# Altium project Badge.PrjPcb
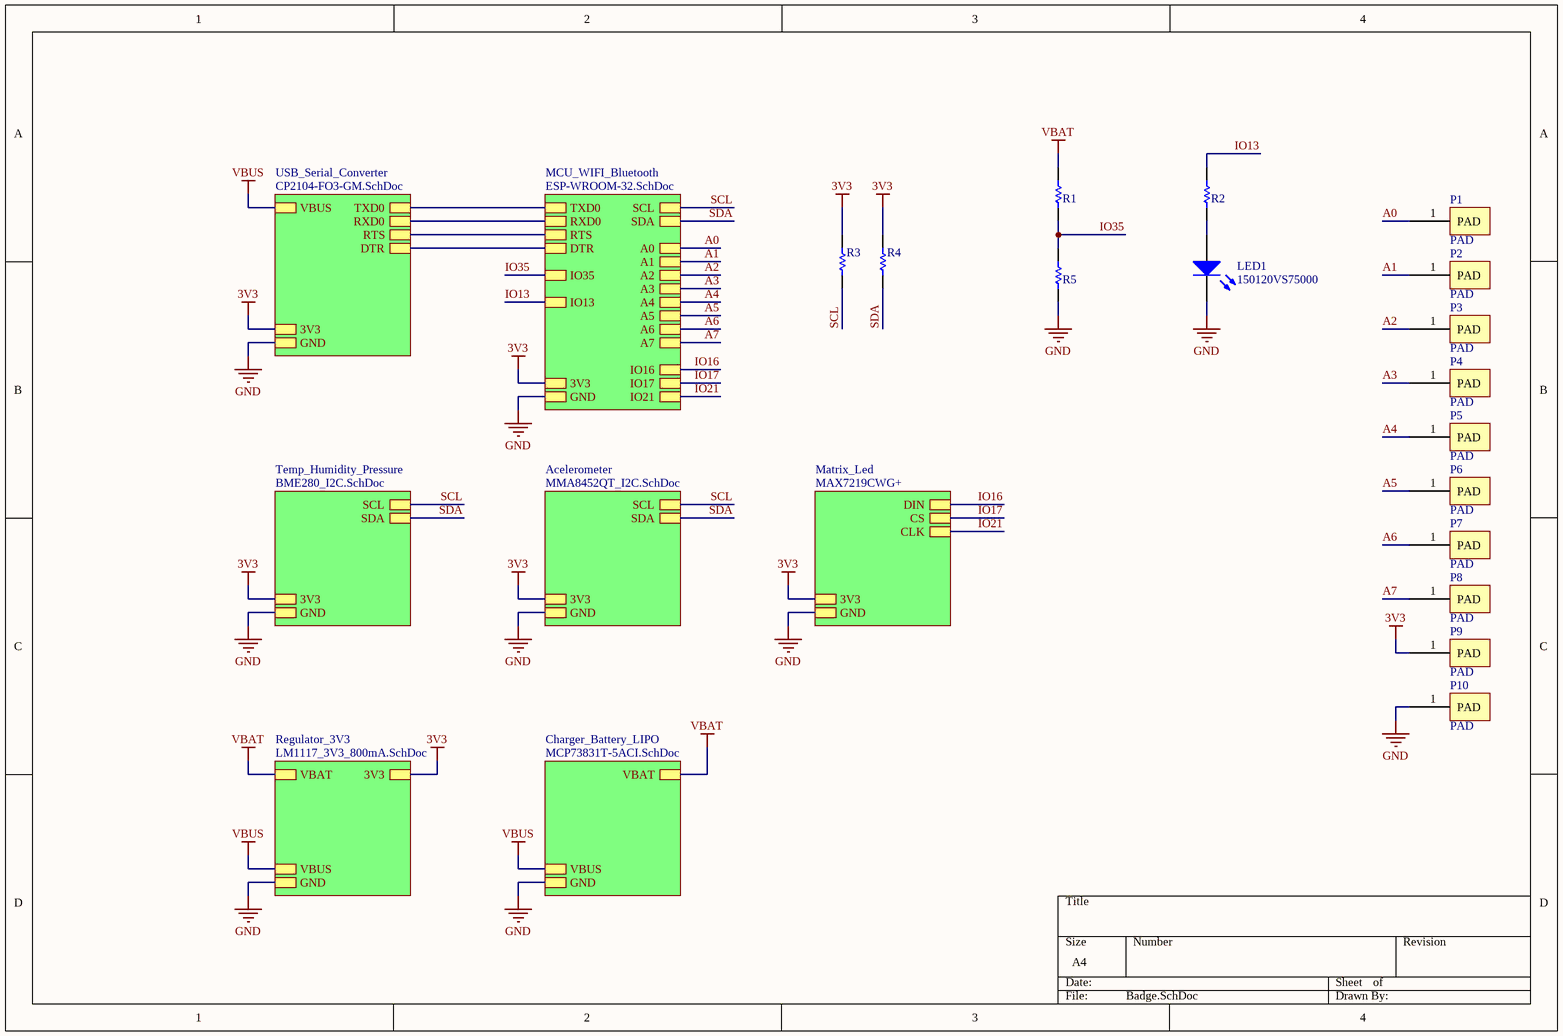
[diagram p0: Badge.SchDoc]
8 sheets, 54 parts. Net scope: hierarchical (ports join the sheet entries above them; power ports are global).
Board files: Badge_V1.PcbDoc, Badge_V1(isidro).PcbDoc, Badge_V2.PcbDoc, Badge_V2(isidro).PcbDoc
Sheets:
  Badge.SchDoc
    USB_Serial_Converter = CP2104-FO3-GM.SchDoc
    MCU_WIFI_Bluetooth = ESP-WROOM-32.SchDoc
    Acelerometer = MMA8452QT_I2C.SchDoc
    Temp_Humidity_Pressure = BME280_I2C.SchDoc
    Regulator_3V3 = LM1117_3V3_800mA.SchDoc
    Matrix_Led = MAX7219CWG+.SchDoc
    Charger_Battery_LIPO = MCP73831T-5ACI.SchDoc

## Sheet Badge.SchDoc
size A4

### Parts
LED1  150120VS75000  [1206_A]
P1  PAD  [Pad_C]
P2  PAD  [Pad_C]
P3  PAD  [Pad_C]
P4  PAD  [Pad_C]
P5  PAD  [Pad_C]
P6  PAD  [Pad_C]
P7  PAD  [Pad_C]
P8  PAD  [Pad_C]
P9  PAD  [Pad_C]
P10  PAD  [Pad_C]
R1  ERA6AEB104V  [RESC2013X60X40NL20T25]  (value not drawn)
R2  ERJ-P06J102V  [RESC2013X70X40NL20T20]  (value not drawn)
R3  RK73B2ATTD103J  [RESC2013X60X30NL20T20]  (value not drawn)
R4  RK73B2ATTD103J  [RESC2013X60X30NL20T20]  (value not drawn)
R5  ERA6AEB104V  [RESC2013X60X40NL20T25]  (value not drawn)

### Sub-sheets
Acelerometer = MMA8452QT_I2C.SchDoc: SDA, SCL, GND, 3V3
Charger_Battery_LIPO = MCP73831T-5ACI.SchDoc: GND, VBUS, VBAT
Matrix_Led = MAX7219CWG+: DIN, CS, CLK, 3V3, GND
MCU_WIFI_Bluetooth = ESP-WROOM-32.SchDoc: RTS, GND, RXD0, 3V3, SDA, DTR, TXD0, SCL, IO16, IO13, IO17, A2, A1, IO35, IO21, A7, A0, A3, A6, A4, A5
Regulator_3V3 = LM1117_3V3_800mA.SchDoc: 3V3, GND, VBUS, VBAT
Temp_Humidity_Pressure = BME280_I2C.SchDoc: GND, SDA, SCL, 3V3
USB_Serial_Converter = CP2104-FO3-GM.SchDoc: TXD0, DTR, RTS, RXD0, VBUS, 3V3, GND

### Nets
3V3: P9.1(PAD) R3.2 R4.2 ; sheet USB_Serial_Converter/3V3, sheet MCU_WIFI_Bluetooth/3V3, sheet Acelerometer/3V3, sheet Temp_Humidity_Pressure/3V3, sheet Regulator_3V3/3V3, sheet Matrix_Led/3V3
GND: LED1.1(K) P10.1(PAD) R5.1 ; sheet USB_Serial_Converter/GND, sheet MCU_WIFI_Bluetooth/GND, sheet Acelerometer/GND, sheet Temp_Humidity_Pressure/GND, sheet Regulator_3V3/GND, sheet Matrix_Led/GND, sheet Charger_Battery_LIPO/GND
VBAT: R1.2 ; sheet Regulator_3V3/VBAT, sheet Charger_Battery_LIPO/VBAT
VBUS: sheet USB_Serial_Converter/VBUS, sheet Regulator_3V3/VBUS, sheet Charger_Battery_LIPO/VBUS
A0: P1.1(PAD) ; sheet MCU_WIFI_Bluetooth/A0
A1: P2.1(PAD) ; sheet MCU_WIFI_Bluetooth/A1
A2: P3.1(PAD) ; sheet MCU_WIFI_Bluetooth/A2
A3: P4.1(PAD) ; sheet MCU_WIFI_Bluetooth/A3
A4: P5.1(PAD) ; sheet MCU_WIFI_Bluetooth/A4
A5: P6.1(PAD) ; sheet MCU_WIFI_Bluetooth/A5
A6: P7.1(PAD) ; sheet MCU_WIFI_Bluetooth/A6
A7: P8.1(PAD) ; sheet MCU_WIFI_Bluetooth/A7
DTR: sheet USB_Serial_Converter/DTR, sheet MCU_WIFI_Bluetooth/DTR
IO13: R2.2 ; sheet MCU_WIFI_Bluetooth/IO13
IO16: sheet MCU_WIFI_Bluetooth/IO16, sheet Matrix_Led/DIN
IO17: sheet MCU_WIFI_Bluetooth/IO17, sheet Matrix_Led/CS
IO21: sheet MCU_WIFI_Bluetooth/IO21, sheet Matrix_Led/CLK
IO35: R1.1 R5.2 ; sheet MCU_WIFI_Bluetooth/IO35
RTS: sheet USB_Serial_Converter/RTS, sheet MCU_WIFI_Bluetooth/RTS
RXD0: sheet USB_Serial_Converter/RXD0, sheet MCU_WIFI_Bluetooth/RXD0
SCL: R3.1 ; sheet MCU_WIFI_Bluetooth/SCL, sheet Acelerometer/SCL, sheet Temp_Humidity_Pressure/SCL
SDA: R4.1 ; sheet MCU_WIFI_Bluetooth/SDA, sheet Acelerometer/SDA, sheet Temp_Humidity_Pressure/SDA
TXD0: sheet USB_Serial_Converter/TXD0, sheet MCU_WIFI_Bluetooth/TXD0
NetLED1_2: LED1.2(A) R2.1

### Library data of the parts
LED1 = CMP-1426-00016-1: SMD mono-color Chip LED, WL-SMCW, Bright Green; Manufacturer: Wuerth Elektronik; ComponentLink2URL: http://katalog.we-online.com/led/datasheet/150120VS75000.pdf; PartNumber: 150120VS75000; Color: Bright Green; ComponentLink2Description: Datasheet; ComponentLink1URL: http://www.we-online.com; PackageReference: 1206_A; ComponentLink1Description: Manufacturer URL
P1-P10 = PAD: PAD 2mm
R1 R5 = CMP-2001-00583-1: 100 kOhms ±0.1% 0.125W, 1/8W Chip Resistor 0805 (2012 Metric) Automotive AEC-Q200 Thin Film; Manufacturer: Panasonic; Part Number: ERA6AEB104V
R2 = CMP-2001-00477-1: RES SMD 1K OHM 5% 1/2W 0805; Manufacturer: Panasonic; Part Number: ERJ-P06J102V
R3 R4 = CMP-2001-04657-1: 10 kOhms ±5% 0.25W, 1/4W Chip Resistor 0805 (2012 Metric) Automotive AEC-Q200, Moisture Resistant Thick Film; Manufacturer: KOA Speer; Part Number: RK73B2ATTD103J

## Sheet CP2104-FO3-GM.SchDoc
size A4
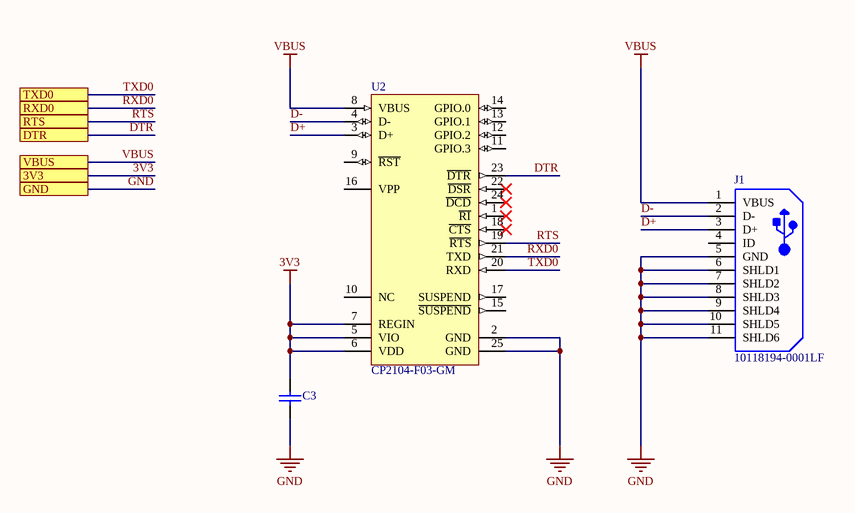
[diagram p1: CP2104-FO3-GM.SchDoc]

### Parts
C3  C0805C106K4PACTU  [CAPC2013X140X50NL20T25]  (value not drawn)
J1  10118194-0001LF  [FCI-10118194-0001LF-5_V]
U2  CP2104-F03-GM  [SLAB-QFN-24-2675x2675TP_M]

### Ports
3V3, DTR, GND, RTS, RXD0, TXD0, VBUS

### Nets
3V3: C3.2 U2.5(VIO) U2.6(VDD) U2.7(REGIN) ; port 3V3
GND: C3.1 J1.5(GND) J1.6(SHLD1) J1.7(SHLD2) J1.8(SHLD3) J1.9(SHLD4) J1.10(SHLD5) J1.11(SHLD6) U2.2(GND) U2.25(GND) ; port GND
VBUS: J1.1(VBUS) U2.8(VBUS) ; port VBUS
D+: J1.3(D+) U2.3(D+)
D-: J1.2(D-) U2.4(D-)
DTR: U2.23(~{DTR}) ; port DTR
RTS: U2.19(~{RTS}) ; port RTS
RXD0: U2.21(TXD) ; port RXD0
TXD0: U2.20(RXD) ; port TXD0

Not connected (* = marked no-connect by the designer): J1 4(ID); U2 1(~{RI})* 9(~{RST}) 10(NC) 11(GPIO.3) 12(GPIO.2) 13(GPIO.1) 14(GPIO.0) 15(~{SUSPEND}) 16(VPP) 17(SUSPEND) 18(~{CTS})* 22(~{DSR})* 24(~{DCD})*

### Library data of the parts
C3 = CMP-2007-03242-1: 10µF ±10% 16V Ceramic Capacitor X5R 0805 (2012 Metric); Part Number: CL21A106KOQNNNG
J1 = CMP-2000-05120-1: Micro USB B Type Receptacle, 1.8 A, -55 to 85 degC, 5-Pin SMD, RoHS, Tape and Reel; Manufacturer: Amphenol FCI; Body Orientation: RightAngle; Number of Contacts: 5; Pitch: 0.65mm; Gender: RCP; Rad Hard: No; Package Reference: 10118194-0001LF-5; Mounting: SurfaceMount; Manufacturer URL: http://www.fci.com/; Packaging: CutTape; Datasheet URL: https://datasheet.ciiva.com/26945/getdatasheetpartid-418619-26945695.pdf; Termination Method: Solder; Package Description: 5-Pin Surface Mount Device, Body 8.05 x 5.53 mm, Pitch 0.65 mm; Type: MicroUSBTypeB; Datasheet Version: Rev. A, 10/2011
U2 = CMP-0511-00004-1: Single-Chip USB to UART Bridge, 4 Dig I/O Pins, Internal Oscillator, 1024 Bytes EEPROM, -40 to 85 degC, 24-pin QFN; Manufacturer: Silicon Labs; Sub-Family: USB Bridges; Internal Oscillator: TRUE; Mounting Technology: Surface Mount; ComponentLink3URL: http://www.silabs.com/Support%20Documents/TechnicalDocs/C8051F93x-92x.pdf; DatasheetVersion: Rev. 1.0; ComponentLink1URL: http://www.silabs.com/; Code_IPC: J-STD-020; ComponentLink2URL: http://www.silabs.com/Support%20Documents/TechnicalDocs/cp2104.pdf; Code_JEDEC: MO-220; PackageReference: QFN-24; ComponentLink3Description: Package Specification; PartNumber: CP2104-F03-GM; ComponentLink1Description: Manufacturer URL; ComponentLink2Description: Datasheet; EEPROM: 1024 Bytes; PackageDescription: 24-Pin Quad-Flat No-Leads Package, Body 4 x 4 mm, Pitch 0.5 mm

## Sheet ESP-WROOM-32.SchDoc
size A4
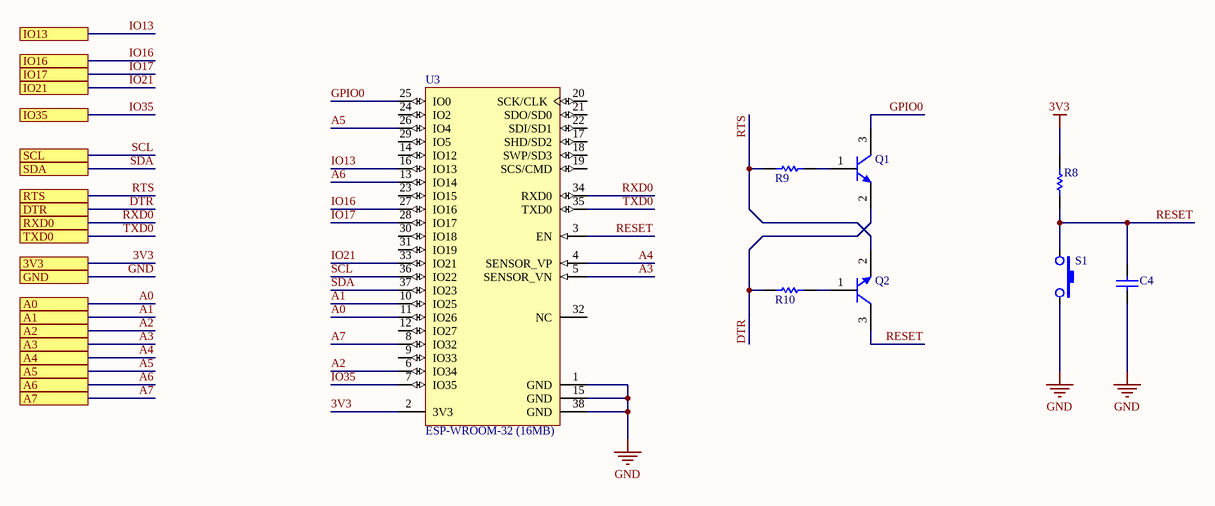
[diagram p2: ESP-WROOM-32.SchDoc]

### Parts
C4  C0805C105K4RAC7800  [CAPC2013X145X50NL20T25]  (value not drawn)
Q1  MMBT2222ALT1G  [ONSC-SOT-23-3-318-08_V]  (value not drawn)
Q2  MMBT2222ALT1G  [ONSC-SOT-23-3-318-08_V]  (value not drawn)
R8  RK73B2ATTD103J  [RESC2013X60X30NL20T20]  (value not drawn)
R9  RK73B2ATTD103J  [RESC2013X60X30NL20T20]  (value not drawn)
R10  RK73B2ATTD103J  [RESC2013X60X30NL20T20]  (value not drawn)
S1  PTS820J25MSMTRLFS  [SMT_SW_PTS_820]  (value not drawn)
U3  ESP-WROOM-32 (16MB)  [OLMX-ESP-WROOM-32]

### Ports
3V3, A0, A1, A2, A3, A4, A5, A6, A7, DTR, GND, IO13, IO16, IO17, IO21, IO35, RTS, RXD0, SCL, SDA, TXD0

### Nets
3V3: R8.2 U3.2(3V3) ; port 3V3
GND: C4.1 S1.2 U3.1(GND) U3.15(GND) U3.38(GND) ; port GND
A0: U3.11(IO26) ; port A0
A1: U3.10(IO25) ; port A1
A2: U3.6(IO34) ; port A2
A3: U3.5(SENSOR_VN) ; port A3
A4: U3.4(SENSOR_VP) ; port A4
A5: U3.26(IO4) ; port A5
A6: U3.13(IO14) ; port A6
A7: U3.8(IO32) ; port A7
DTR: Q1.2(E) R10.2 ; port DTR
GPIO0: Q1.3(C) U3.25(IO0)
IO13: U3.16(IO13) ; port IO13
IO16: U3.27(IO16) ; port IO16
IO17: U3.28(IO17) ; port IO17
IO21: U3.33(IO21) ; port IO21
IO35: U3.7(IO35) ; port IO35
RESET: C4.2 Q2.3(C) R8.1 S1.1 U3.3(EN)
RTS: Q2.2(E) R9.2 ; port RTS
RXD0: U3.34(RXD0) ; port RXD0
SCL: U3.36(IO22) ; port SCL
SDA: U3.37(IO23) ; port SDA
TXD0: U3.35(TXD0) ; port TXD0
NetQ1_1: Q1.1(B) R9.1
NetQ2_1: Q2.1(B) R10.1

Not connected (* = marked no-connect by the designer): U3 9(IO33) 12(IO27) 14(IO12) 17(SHD/SD2) 18(SWP/SD3) 19(SCS/CMD) 20(SCK/CLK) 21(SDO/SD0) 22(SDI/SD1) 23(IO15) 24(IO2) 29(IO5) 30(IO18) 31(IO19) 32(NC)

### Library data of the parts
C4 = CMP-2007-01082-1: 1µF ±10% 16V Ceramic Capacitor X7R 0805 (2012 Metric); Manufacturer: Kemet; Part Number: C0805C105K4RAC7800
Q1 Q2 = CMP-1048-00538-1: General Purpose Transistor, NPN Silicon, 3-Pin SOT-23, Pb-Free, Tape and Reel; Manufacturer: On Semiconductor; fT Min (MHz): 300; IC Continuous (A): 0.6; ComponentLink3URL: http://www.onsemi.cn/pub_link/Collateral/318-08.PDF; PartNumber: MMBT2222ALT1G; RoHS: TRUE; ComponentLink1URL: http://www.onsemi.com/; ComponentLink3Description: Package Specification; ComponentLink2Description: Datasheet; Mounting Technology: Surface Mount; Packing: Tape and Reel; PackageDescription: 3-Pin Small Outline Transistor, Body 2.92 x 1.3 mm, Pitch 0.95 mm; DatasheetVersion: Rev. 10; PackageReference: SOT-23-3-318-08; ComponentLink2URL: http://www.onsemi.cn/pub_link/Collateral/MMBT2222LT1-D.PDF; Polarity: NPN; PackageVersion: Rev. AP, 11/2009; ComponentLink1Description: Manufacturer URL
R8-R10 = CMP-2001-04657-1: as R3 on sheet Badge; Part Number: RK73B2ATTD103J
S1 = PTS820J25MSMTRLFS: Tactile Switch SPST-NO Top Actuated Surface Moun
U3 = CMP-2000-07454-1: Espressif System, 2.7 to 3.6 V, -40 to 85 degC, 38-Pin SMD; Package Description: 38-Pin Surface Mount Device, Body 18 x 25.5 mm, Pitch 1.27 mm; RoHSCompliant: false; Mounting Technology: SurfaceMount; Package Reference: ESP-WROOM-32 (16MB)

## Sheet MMA8452QT_I2C.SchDoc
size A4
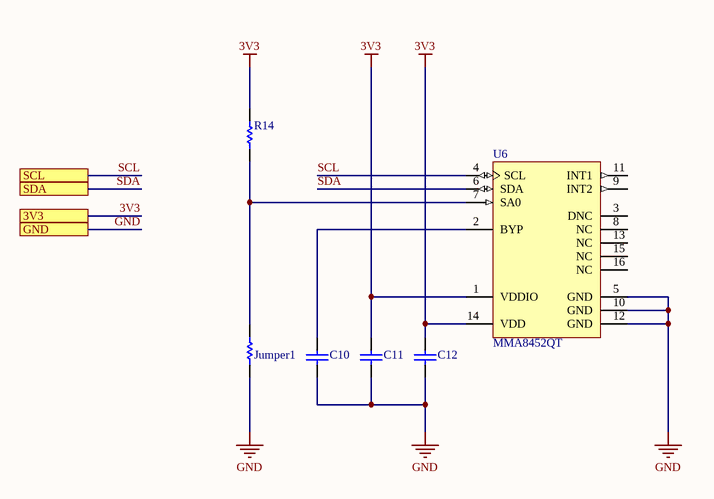
[diagram p3: MMA8452QT_I2C.SchDoc]

### Parts
C10  C0805C104J5RAC7800  [CAPC2013X145X50NL20T25]  (value not drawn)
C11  C0805C104J5RAC7800  [CAPC2013X145X50NL20T25]  (value not drawn)
C12  08053D475KAT2A  [CAPC2013X140X50NL20T25]  (value not drawn)
Jumper1  (no value)  [RESC2013X60X40NL20T25_A]
R14  RK73B2ATTD103J  [RESC2013X60X30NL20T20]  (value not drawn)
U6  MMA8452QT  [FRES-SOT1676-1_V]

### Ports
3V3, GND, SCL, SDA

### Nets
3V3: C11.2 C12.2 R14.2 U6.1(VDDIO) U6.14(VDD) ; port 3V3
GND: C10.1 C11.1 C12.1 Jumper1.1 U6.5(GND) U6.10(GND) U6.12(GND) ; port GND
SCL: U6.4(SCL) ; port SCL
SDA: U6.6(SDA) ; port SDA
NetC10_2: C10.2 U6.2(BYP)
NetJumper1_2: Jumper1.2 R14.1 U6.7(SA0)

Not connected (* = marked no-connect by the designer): U6 3(DNC) 8(NC) 9(INT2) 11(INT1) 13(NC) 15(NC) 16(NC)

### Library data of the parts
C10 C11 = CMP-2007-01102-1: 0.1µF ±5% 50V Ceramic Capacitor X7R 0805 (2012 Metric); Manufacturer: Kemet; Part Number: C0805C104J5RAC7800
C12 = CMP-2007-04614-1: 4.7µF ±10% 25V Ceramic Capacitor X5R 0805 (2012 Metric); Manufacturer: AVX Interconnect / Elco; Part Number: 08053D475KAT2A
Jumper1 = CMP-2000-06228-1: Tolerance: 0.1%; Voltage Rating: 100V; Power Rating: 125mW(1/8W); Brand: Panasonic; Temperature Coefficient: 25PPM/C; Resistance: 10kOhms; Product Category: ThinFilmResistors-SMD; Operating Temperature Range: -55Cto+155C; Length: 2mm; Mounting Technology: SurfaceMount; Manufacturer URL: http://www.panasonic.com/; Width: 1.25mm; Packaging: Reel; Product: ThinFilmResistorsSMD; Package / Case: 0805(2012metric); Termination Style: SMD/SMT; Package Description: 2-Pin Surface Mount Device, Body 2 x 1.25 mm; Factory Pack Quantity: 5000; Series: ERA-6A; Case Code - mm: 2012; RoHS: Details; Package Reference: 0805; Height: 0.5mm; Manufacturer: Panasonic; Case Code - in: 0805; Type: MetalFilmChipResistors
R14 = CMP-2001-04657-1: as R3 on sheet Badge; Part Number: RK73B2ATTD103J
U6 = CMP-2000-06726-1: 3-Axis, 12-Bit / 8-Bit Digital Accelerometer, 1.95 to 3.6 V, -40 to 85 degC, 16-Pin QFN (SOT1676-1), RoHS, Tray; Manufacturer: Freescale; Maximum Frequency Response: 400kHz; Frequency Response Range: 0→400kHz; Noise: 99µg/√Hz; Sensitivity: 256counts/g,512counts/g,1024counts/g; Interface Type: Serial-I2C; Minimum Operating Supply Voltage: 1.95V; Operating Supply Voltage Range: 1.95→3.6V; Package Version: Rev. B, 01/2016; Minimum Frequency Response: 0kHz; Maximum Operating Supply Voltage: 3.6V; Number of Axis: 3; Sensor Range: ±2g,±4g,±8g; Technology: Digital; Minimum Operating Temperature: -40°C; Mounting Type: SurfaceMount; Datasheet URL: http://cache.nxp.com/files/sensors/doc/data_sheet/MMA8452Q.pdf?fpsp=1&WT_TYPE=Data%20Sheets&WT_VENDOR=FREESCALE&WT_FILE_FORMAT=pdf&WT_ASSET=Documentation&fileExt=.pdf; Operating Temperature Range: -40→+85°C; Height: 1mm; Package Description: 16-Pin Quad Flat No-lead Package, Body 3 x 3 mm, Pitch 0.5 mm; Dimensions: 3x3x1mm; Mounting Technology: SurfaceMount; Pin Count: 16; Package Type: QFN; Length: 3mm; Datasheet Version: Rev. 10, 04/2016; Package Reference: SOT1676-1; Width: 3mm; Maximum Operating Temperature: +85°C; Package URL: http://cache.freescale.com/files/shared/doc/package_info/98ASA00063D.pdf; Manufacturer URL: http://www.nxp.com/

## Sheet BME280_I2C.SchDoc
size A4
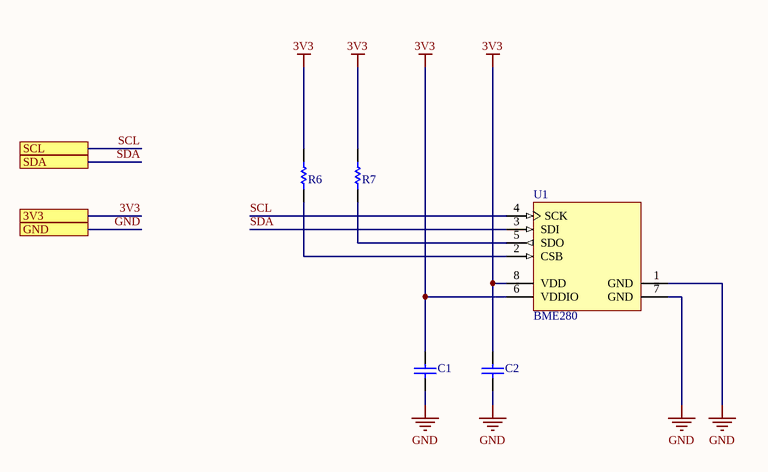
[diagram p4: BME280_I2C.SchDoc]

### Parts
C1  C0805C104J5RAC7800  [CAPC2013X145X50NL20T25]  (value not drawn)
C2  C0805C104J5RAC7800  [CAPC2013X145X50NL20T25]  (value not drawn)
R6  RC0805JR-074K7L  [RESC2013X60X30NL20T20]  (value not drawn)
R7  RC0805JR-074K7L  [RESC2013X60X30NL20T20]  (value not drawn)
U1  BME280  [BOSC-BME280-8_V]

### Ports
3V3, GND, SCL, SDA

### Nets
3V3: C1.2 C2.2 R6.2 R7.2 U1.6(VDDIO) U1.8(VDD) ; port 3V3
GND: C1.1 C2.1 U1.1(GND) U1.7(GND) ; port GND
SCL: U1.4(SCK) ; port SCL
SDA: U1.3(SDI) ; port SDA
NetR6_1: R6.1 U1.2(CSB)
NetR7_1: R7.1 U1.5(SDO)

### Library data of the parts
C1 C2 = CMP-2007-01102-1: as C10 on sheet MMA8452QT_I2C; Part Number: C0805C104J5RAC7800
R6 R7 = RC0805JR-074K7L: 4.7 kOhms ±5% 0.125W, 1/8W Chip Resistor 0805 (2012 Metric) Moisture Resistant Thick Film; Manufacturer: Yageo; Part Number: RC0805JR-074K7L
U1 = CMP-2000-05073-1: Combined Humidity and Pressure Sensor, 1.71 to 3.6 V, -40 to 85 degC, 8-Pin SMD, RoHS, Tape and Reel; Manufacturer: Bosch Sensortec; Datasheet Version: Rev. 1.2, 10/2015; Datasheet URL: http://datasheet.octopart.com/BME280-Bosch-datasheet-58577763.pdf; Manufacturer URL: http://www.bosch-sensortec.com; ComponentLink1Description: BME280; ComponentLink1URL: https://co.mouser.com/ProductDetail/Bosch-Sensortec/BME280?qs=sGAEpiMZZMsF1ODjcwEocB0teEbUEBlMe2ty%252bXJvNLw%3d

## Sheet LM1117_3V3_800mA.SchDoc
size A4
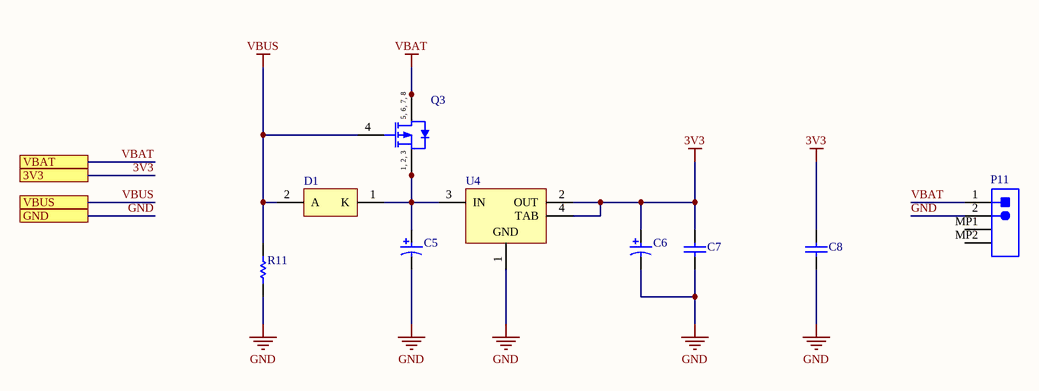
[diagram p5: LM1117_3V3_800mA.SchDoc]

### Parts
C5  T491A106K016AT  [KEMT-A-3216-18-2_N]  (value not drawn)
C6  T491A106K016AT  [KEMT-A-3216-18-2_N]  (value not drawn)
C7  C0805C105K4RAC7800  [CAPC2013X145X50ML20T25]  (value not drawn)
C8  C0805C106K4PACTU  [CAPC2013X140X50ML20T25]  (value not drawn)
D1  MBR120ESFT1G  [ONSC-SOD-123FL-2-498_V]  (value not drawn)
P11  S2B-PH-SM4-TB(LF)(SN)  [JST- S2B-PH-SM4-TB(LF)(SN)-2_V]  (value not drawn)
Q3  BSZ086P03NS3 G  [INF-PG-TSDSON-8-1_V]  (value not drawn)
R11  ERA6AEB104V  [RESC2013X60X40ML20T25]  (value not drawn)
U4  LM1117MPX-3.3/NOPB  [DCY0004A_N]  (value not drawn)

### Ports
3V3, GND, VBAT, VBUS

### Nets
3V3: C6.1 C7.2 C8.2 U4.2(OUT) U4.4(TAB) ; port 3V3
GND: C5.2 C6.2 C7.1 C8.1 P11.2 R11.1 U4.1(GND) ; port GND
VBAT: P11.1 Q3.5(DRAIN) Q3.6(DRAIN) Q3.7(DRAIN) Q3.8(DRAIN) ; port VBAT
VBUS: D1.2(A) Q3.4(GATE) R11.2 ; port VBUS
NetC5_1: C5.1 D1.1(K) Q3.1(SOURCE) Q3.2(SOURCE) Q3.3(SOURCE) U4.3(IN)

Not connected (* = marked no-connect by the designer): P11 MP1 MP2

### Notes on the sheet
- (in symbol CMP-1099-00063-1) 5, 6, 7, 8; 1, 2, 3

### Library data of the parts
C5 C6 = CMP-2000-05173-1: Capacitor, Tantalum, 10 uF, +/- 10%, 16 V, -55 to 125 degC, 2-Pin SMD (1206), RoHS, Tape and Reel; Manufacturer: Kemet; Insulation: NotRequired; Voltage: 16VDC; Capacitance: 10uF; Product Height (mm): 1.6mm; Polarity: Polar; Lead Spacing (nom): NotRequiredmm; Product Length (mm): 3.2mm; Case Style: Molded; DCL: 1.6uA; ESR: 7ohm; DF: 8%; Mounting Style: SurfaceMount; Manufacturer URL: http://www.kemet.com/; Datasheet Version: Apr-14; Package Description: 2-Pin Surface Mount Device, Body 3.2 x 1.6 mm; Operating Temp Range: -55Cto125C; Package Reference: 1206; Wire Form: NotRequired; Datasheet URL: http://www.farnell.com/datasheets/1824869.pdf; Tolerance (+ or -): 10%; Failure Rate: NotRequired; Length W/Weld: NotRequiredmm; Package / Case: 3216-18; Seated Plane Height: NotRequiredmm; Product Diameter (mm): NotRequiredmm; Construction: SMTChip; Seal: NotRequired; Case Code: A; Product Depth (mm): 1.6mm; Packaging: TapeandReel
C7 = CMP-2007-01082-1: as C4 on sheet ESP-WROOM-32; Part Number: C0805C105K4RAC7800
C8 = CMP-2007-03242-1: as C3 on sheet CP2104-FO3-GM
D1 = CMP-1055-00434-1: Schottky Power Rectifier, 2-Pin SOD-123, Pb-Free, Tape and Reel; Manufacturer: On Semiconductor; Configuration: Single; IFSM Max (A): 40; ComponentLink2URL: http://www.onsemi.cn/pub_link/Collateral/MBR120ESFT1-D.PDF; PackageDescription: 2-Pin SOD, Body 1.65 x 2.7 mm; RoHS: TRUE; ComponentLink1URL: http://www.onsemi.com/; PackageVersion: Rev. D, 05/2013; PartNumber: MBR120ESFT1G; PackageReference: SOD-123FL-2-498; ComponentLink2Description: Datasheet; ComponentLink1Description: Manufacturer URL; DatasheetVersion: Rev. 4; ComponentLink3Description: Package Specification; ComponentLink3URL: http://www.onsemi.com/pub_link/Collateral/498-01.PDF; Mounting Technology: Surface Mount; Packing: Tape and Reel
P11 = CMP-1755-00001-1: Male Header, Pitch 2 mm, 1 x 2 Position, Height 5.5 mm, -25 to 85 degC, RoHS, Tape and Reel; Current Rating: 3 A; ComponentLink1URL: http://www.jst.com/home2.html; Radiation Hardening: No; RoHSCompliant: True; Mount: Through Hole; Contact Material: Bronze; Package Quantity: 100; Width: 2.34 mm; DatasheetVersion: Dec-12; Height: 8.13 mm; Max Operating Temperature: 105degC; ComponentLink2Description: Datasheet; Lead Pitch: 0.1 inch; Contact Finish: Lead; Packaging: Bulk; Colour: Black; Contact Plating: Tin; Min Operating Temperature: -65degC; ComponentLink1Description: Manufacturer URL; PackageReference: S2B-PH-SM4-TB(LF)(SN)-2; PackageDescription: Male Header, Pitch 2 mm, 1 x 2 Position, Height 5.5 mm; ComponentLink2URL: http://www.jst-mfg.com/product/pdf/eng/ePH.pdf; Pins: 40; Length: 101.19 mm
Q3 = CMP-1099-00063-1: P-Channel OptiMOS P3 Power-Transistor, -30 V VDS, -40 A ID, -55 to 150 degC, PG-TSDSON-8-1, Reel, Green; Manufacturer: Infineon; RDS (on) (max): 8.6Â mOhm; Rth: 1.8Â K/W; QG: 43.2Â nC; VGS(th) (max): -1.9Â V; RthJC (max): 1.8 K/W; Green: TRUE; Pto t (max): 69Â W; ID (max): -40Â A; IDpuls (max): -160Â A; VDS (max): -30Â V; VGS(th) (min): -3.1Â V; ComponentLink1URL: http://www.infineon.com/; ComponentLink2URL: http://www.infineon.com/dgdl/BSZ086P03NS3+G_2.03.pdf?folderId=db3a304314dca38901154a7313d21a66&fileId=db3a30431ff9881501203d3a5e7d17a9; Mounting Technology: Surface Mount; Part Number: BSZ086P03NS3 G; Packing: Reel; PackageVersion: Rev. 02, 09/2008; Halogen-free: TRUE; ComponentLink3URL: http://www.infineon.com/dgdl/BSZ240N12NS3+Rev2.0.pdf?folderId=db3a304313b8b5a60113cee8763b02d7&fileId=db3a30432a40a650012a42f3057a0038; PackageDescription: 8-Pin Plastic (Green) Thin Dual Small Outline Non-Leaded Package, 3.3 x 3.3 mm Body, 0.65 mm Pitch; PackageReference: PG-TSDSON-8-1; DatasheetVersion: Rev. 2.03; ComponentLink2Description: Datasheet; ComponentLink3Description: Package Specification; ComponentLink1Description: Manufacturer URL
R11 = CMP-2001-00583-1: as R1 on sheet Badge; Part Number: ERA6AEB104V
U4 = CMP-0062-01639-4: 800mA Low-Dropout Linear Regulator, 4-pin SOT-223, Pb-Free; Manufacturer: Texas Instruments; High-Reliability: Y; PowerWise: N; PackageTopMarking: XYTT*N05A; CompType: LDO IC; ComponentLink1URL: http://www.ti.com/general/docs/lit/getliterature.tsp?genericPartNumber=LM1117-N&fileType=pdf; PartNumber: LM1117MPX-3.3/NOPB; ComponentLink1Description: Datasheet URL; PinCount: 4; Code_JEDEC: TO-261-AA; PackageDescription: Molded SOT-223, 6.50 x 3.56 x 1.6mm Body, 4 Lead, 2.3mm Pitch; PackageReference: DCY0004A; RoHS: Y; Code_IPC: SOT223-4

## Sheet MAX7219CWG+.SchDoc
size A4
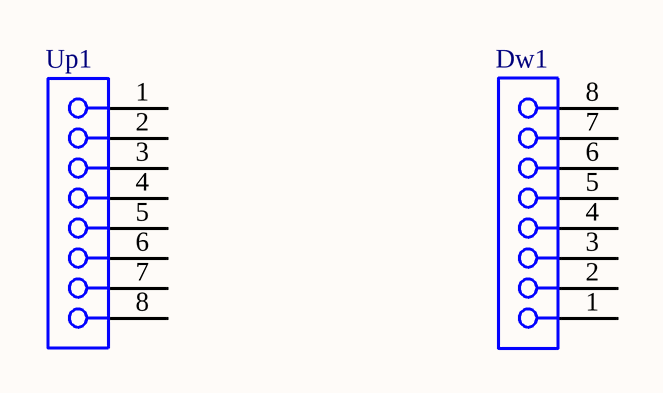
[diagram p6: MAX7219CWG+.SchDoc]

### Parts
Dw1  SSQ-108-01-G-S  [SMTC-SSQ-108-01-X-S]  (value not drawn)
Up1  SSQ-108-01-G-S  [SMTC-SSQ-108-01-X-S]  (value not drawn)

### Nets

Not connected (* = marked no-connect by the designer): Dw1 1 2 3 4 5 6 7 8; Up1 1 2 3 4 5 6 7 8

### Library data of the parts
Dw1 Up1 = CMP-1023-00292-1: SQ Post Socket, Through-hole, Vertical, -55 to 125 degC, 2.54 mm Pitch, 8-Pin, Female, RoHS; Manufacturer: Samtec; Pitch: 2.54 mm; ComponentLink3URL: http://www.samtec.com/documents/webfiles/cpdf/SSQ-1XX-XX-XXX-X-XX-XXX-XX-X-MKT.pdf; ComponentLink3Description: Package Specification; RoHS: True; ComponentLink1URL: http://www.samtec.com; Mounting Technology: Through-hole; PackageVersion: BD, 6/1987; ComponentLink1Description: Manufacturer URL; PartNumber: SSQ-108-01-G-S; ComponentLink2Description: Datasheet; Temperature Range: -55 to 125 degC; ComponentLink2URL: http://www.samtec.com/documents/webfiles/pdf/SSQ_TH.PDF; PackageDescription: Assembly, Socket Strip .025[0.64] SQ Tail; PackageReference: SSQ-108-01-X-S; Orientation: Vertical; DatasheetVersion: F-214

## Sheet MCP73831T-5ACI.SchDoc
size A4
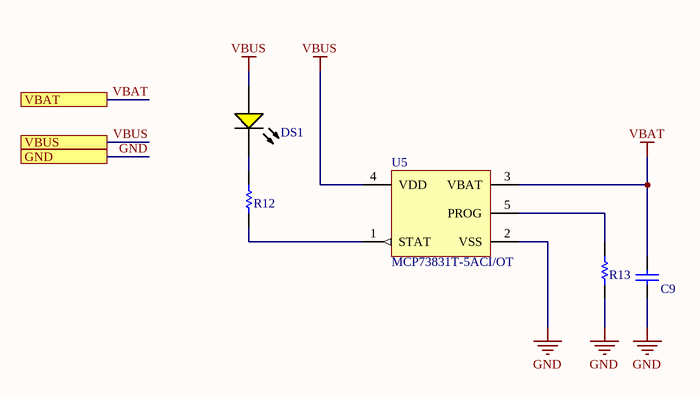
[diagram p7: MCP73831T-5ACI.SchDoc]

### Parts
C9  C0805C106K4PACTU  [CAPC2013X140X50NL20T25]  (value not drawn)
DS1  LTST-C150KSKT  [LTST-C150KSKT_V]  (value not drawn)
R12  ERJ-P06J102V  [RESC2013X70X40NL20T20]  (value not drawn)
R13  RC0805JR-074K7L  [RESC2013X60X30NL20T20]  (value not drawn)
U5  MCP73831T-5ACI/OT  [SOT-23-OT5_N]

### Ports
GND, VBAT, VBUS

### Nets
GND: C9.2 R13.2 U5.2(VSS) ; port GND
VBAT: C9.1 U5.3(VBAT) ; port VBAT
VBUS: DS1.1(A) U5.4(VDD) ; port VBUS
NetDS1_2: DS1.2(K) R12.2
NetR12_1: R12.1 U5.1(STAT)
NetR13_1: R13.1 U5.5(PROG)

### Library data of the parts
C9 = CMP-2007-03242-1: as C3 on sheet CP2104-FO3-GM
DS1 = CMP-2000-06618-1: LED Yellow, 75 mW, 80 mA, -55 to 85 degC, 2-Pin SMD, RoHS, Tape and Reel; Manufacturer: Lite-On; Forward Current: 30mA; Product Depth (mm): 1.6mm; DELETED: Compliant; Product Length (mm): 3.2mm; Type: Uni-Color; Product Height (mm): 1.1mm; Viewing Angle: 130deg; Number of  Elements: 1; Main Category: ChipLED; Forward Voltage: 2.4V; Test Current (It): 20mA; Shape Type: Rectangular; Chip Material: AlGaInP; Rad Hardened: No; Emitting Color: Amber; Luminous Intensity: 60mcd; High Brightness: Yes; Dominant Wave Length: 587nm; Reverse Voltage: 5V; Peak Wavelength: 588nm; Power Dissipation: 75W; Packaging: TapeandReel; Lens Dimensions: 2.06X1.6X0.6mm; Operating Temp Range: -55Cto85C; Pin Count: 2; Datasheet Version: Rev. E, 02/2005; Package Description: 2-Pin Surface Mount Device, Body 3.2 x 1.6 mm; Mounting: SurfaceMount; Datasheet URL: http://optoelectronics.liteon.com/upload/download/DS-22-99-0187/S_110_LTST-C150KSKT.pdf; Package Reference: C150KSKT; Manufacturer URL: http://www.us.liteon.com/; Operating Temperature Classification: Industrial; Package Type: ChipLed; Mounting Technology: SurfaceMount; Lum Intensity: 60mcd
R12 = CMP-2001-00477-1: as R2 on sheet Badge; Part Number: ERJ-P06J102V
R13 = RC0805JR-074K7L: as R6 on sheet BME280_I2C; Part Number: RC0805JR-074K7L
U5 = CMP-0133-00136-1: Miniature Single-Cell, Fully Integrated Li-Ion, Li-Polymer Charge Management Controller, 4.5V, 5-Pin SOT-23, Industrial Temperature, Tape and Reel; PackageReference: SOT-23-OT5; PackageDescription: 5-Lead Plastic Small Outline Transistor (OT) [SOT-23]; PackageVersion: revBB, Aug-2009; DatasheetVersion: revE, Sep-2008; Code_IPC: SOT23-5

## Nets that join several sheets
3V3: Badge (P9.1 R3.2 R4.2), CP2104-FO3-GM (C3.2 U2.5 U2.6 U2.7), ESP-WROOM-32 (R8.2 U3.2), MMA8452QT_I2C (5 pins), BME280_I2C (6 pins), LM1117_3V3_800mA (5 pins)
GND: Badge (LED1.1 P10.1 R5.1), CP2104-FO3-GM (10 pins), ESP-WROOM-32 (5 pins), MMA8452QT_I2C (7 pins), BME280_I2C (C1.1 C2.1 U1.1 U1.7), LM1117_3V3_800mA (7 pins), MCP73831T-5ACI (C9.2 R13.2 U5.2)
VBAT: Badge (R1.2), LM1117_3V3_800mA (5 pins), MCP73831T-5ACI (C9.1 U5.3)
VBUS: CP2104-FO3-GM (J1.1 U2.8), LM1117_3V3_800mA (D1.2 Q3.4 R11.2), MCP73831T-5ACI (DS1.1 U5.4)
A0: Badge (P1.1), ESP-WROOM-32 (U3.11)
A1: Badge (P2.1), ESP-WROOM-32 (U3.10)
A2: Badge (P3.1), ESP-WROOM-32 (U3.6)
A3: Badge (P4.1), ESP-WROOM-32 (U3.5)
A4: Badge (P5.1), ESP-WROOM-32 (U3.4)
A5: Badge (P6.1), ESP-WROOM-32 (U3.26)
A6: Badge (P7.1), ESP-WROOM-32 (U3.13)
A7: Badge (P8.1), ESP-WROOM-32 (U3.8)
DTR: CP2104-FO3-GM (U2.23), ESP-WROOM-32 (Q1.2 R10.2)
IO13: Badge (R2.2), ESP-WROOM-32 (U3.16)
IO35: Badge (R1.1 R5.2), ESP-WROOM-32 (U3.7)
RTS: CP2104-FO3-GM (U2.19), ESP-WROOM-32 (Q2.2 R9.2)
RXD0: CP2104-FO3-GM (U2.21), ESP-WROOM-32 (U3.34)
SCL: Badge (R3.1), ESP-WROOM-32 (U3.36), MMA8452QT_I2C (U6.4), BME280_I2C (U1.4)
SDA: Badge (R4.1), ESP-WROOM-32 (U3.37), MMA8452QT_I2C (U6.6), BME280_I2C (U1.3)
TXD0: CP2104-FO3-GM (U2.20), ESP-WROOM-32 (U3.35)